# EAGLE design GPS_radiologger_v19_LoRa_only (EAGLE 9.6.2)
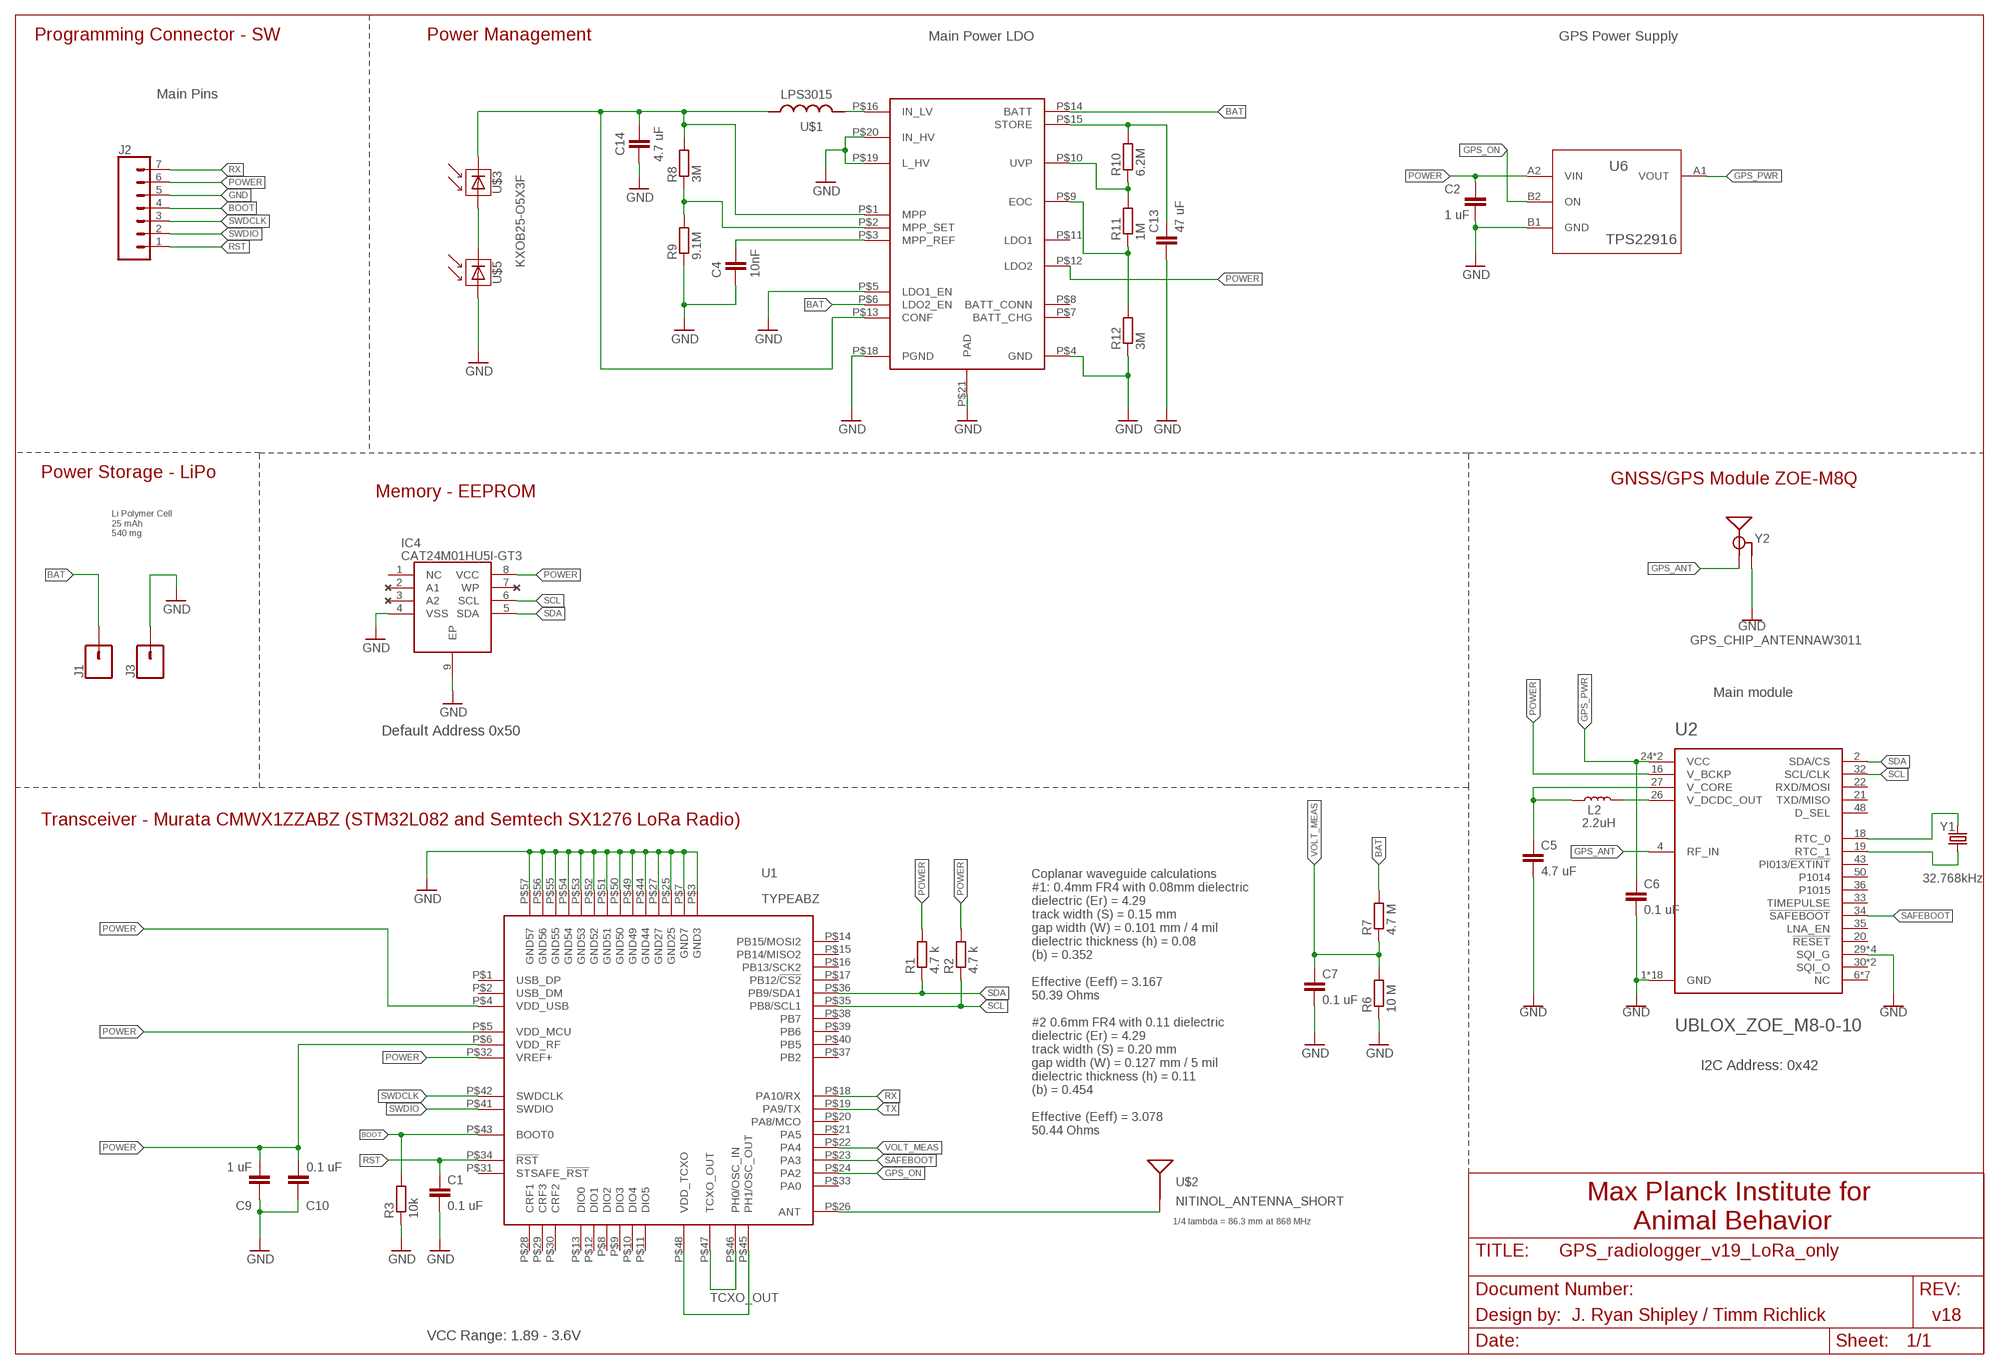
[diagram p0: schematic, sheet 1]

## Parts
C1  0.1 uF  C-EUC0201  [C0201]
C2  1 uF  C-EUC0201  [C0201]
C4  10nF  C-EUC0201  [C0201]
C5  4.7 uF  C-EUC0201  [C0201]
C6  0.1 uF  C-EUC0201  [C0201]
C7  0.1 uF  C-EUC0201  [C0201]
C9  1 uF  C-EUC0201  [C0201]
C10  0.1 uF  C-EUC0201  [C0201]
C13  47 uF  C-EUC0805K  [C0805K]
C14  4.7 uF  C-EUC0201  [C0201]
IC4  CAT24M01HU5I-GT3  [SON50P300X200X55-9N]
J1  CONN_01PTH_NO_SILK_YES_STOP  [1X01_NO_SILK]
J2  CONN_07NO_SILK  [1X07_NO_SILK]
J3  CONN_01PTH_NO_SILK_YES_STOP  [1X01_NO_SILK]
L2  2.2uH  2.2μH_SHIELDED_INDUCTOR  [0806]
R1  4.7 k  R-EU_R0201  [R0201]
R2  4.7 k  R-EU_R0201  [R0201]
R3  10k  R-EU_R0201  [R0201]
R6  10 M  R-EU_R0201  [R0201]
R7  4.7 M  R-EU_R0201  [R0201]
R8  3M  R-EU_R0201  [R0201]
R9  9.1M  R-EU_R0201  [R0201]
R10  6.2M  R-EU_R0201  [R0201]
R11  1M  R-EU_R0201  [R0201]
R12  3M  R-EU_R0201  [R0201]
U1  TYPEABZ  [TYPEABZ]
U2  UBLOX_ZOE_M8-0-10  [UBLOX_ZOE_M8-0-10]
U4  SPV1050  [SPV1050]
U6  TPS22916  [TPS22916]
U$1  LPS3015  [LPS_3015]
U$2  NITINOL_ANTENNA_SHORT  [ICARUS_NITINOL_ANTENNA_SHORT]
U$3  KXOB25-O5X3F  [KXOB25-05X3F]
U$5  KXOB25-O5X3F  [KXOB25-05X3F]
Y1  32.768kHz  CRYSTAL-32.768KHZSMD-3.2X1.5  [CRYSTAL-SMD-3.2X1.5MM]
Y2  GPS_CHIP_ANTENNAW3011  [W3011]

## Nets
BAT [battery]: J1.1 R7.2 U4.P$6(LDO2_EN) U4.P$14(BATT)
BOOT: J2.4 R3.2 U1.P$43(BOOT0)
GND: C1.2 C2.2 C4.2 C5.2 C6.2 C7.2 C9.1 C10.1 C13.2 C14.2 IC4.4(VSS) IC4.9(EP) J2.5 J3.1 R3.1 R6.1 R9.1 R12.1 U1.P$3(GND3) U1.P$7(GND7) U1.P$25(GND25) U1.P$27(GND27) U1.P$44(GND44) U1.P$49(GND49) U1.P$50(GND50) U1.P$51(GND51) U1.P$52(GND52) U1.P$53(GND53) U1.P$54(GND54) U1.P$55(GND55) U1.P$56(GND56) U1.P$57(GND57) U2.1(GND) U2.3(GND) U2.5(GND) U2.7(GND) U2.8(GND) U2.9(GND) U2.10(GND) U2.11(GND) U2.12(GND) U2.17(GND) U2.23(GND) U2.29(SQI_G) U2.31(SQI_G) U2.37(GND) U2.38(GND) U2.39(GND) U2.40(GND) U2.41(GND) U2.44(GND) U2.46(SQI_G) U2.47(SQI_G) U2.49(GND) U4.P$4(GND) U4.P$5(LDO1_EN) U4.P$18(PGND) U4.P$19(L_HV) U4.P$20(IN_HV) U4.P$21(PAD) U6.B1(GND) U$5.P$2(MINUS) Y2.2(GND) Y2.3(GND)
GPS_ANT: U2.4(RF_IN) Y2.1(SIGNAL)
GPS_ON: U1.P$24(PA2) U6.B2(ON)
GPS_PWR: C6.1 U2.24(VCC) U2.25(VCC) U6.A1(VOUT)
N$1: U1.P$45(PH1/OSC_OUT) U1.P$48(VDD_TCXO)
N$2: U$3.P$2(MINUS) U$5.P$1(PLUS)
N$3: L2.2 U2.26(V_DCDC_OUT)
N$4: U4.P$16(IN_LV) U$1.P$2
N$5: C5.1 L2.1 U2.27(V_CORE)
N$6: R8.1 R9.2 U4.P$2(MPP_SET)
N$7 [battery]: C14.1 R8.2 U4.P$1(MPP) U4.P$13(CONF) U$1.P$1 U$3.P$1(PLUS)
N$8: R10.1 R11.2 U4.P$10(UVP)
N$9: R11.1 R12.2 U4.P$9(EOC)
N$11 [antenna]: U1.P$26(ANT) U$2.1(SIGNAL) U$2.2(SIGNAL) U$2.3(SIGNAL)
N$12: C13.1 R10.2 U4.P$15(STORE)
N$13: C4.1 U4.P$3(MPP_REF)
N$14: U2.18(RTC_0) Y1.P$2
N$15: U2.19(RTC_1) Y1.P$1
POWER [power]: C2.1 C9.2 C10.2 IC4.8(VCC) J2.6 R1.2 R2.2 U1.P$4(VDD_USB) U1.P$5(VDD_MCU) U1.P$6(VDD_RF) U1.P$32(VREF+) U2.16(V_BCKP) U4.P$12(LDO2) U6.A2(VIN)
RST: C1.1 J2.1 U1.P$34(!RST)
RX: J2.7 U1.P$18(PA10/RX)
SAFEBOOT: U1.P$23(PA3) U2.34(!SAFEBOOT)
SCL: IC4.6(SCL) R2.1 U1.P$35(PB8/SCL1) U2.32(SCL/CLK)
SDA: IC4.5(SDA) R1.1 U1.P$36(PB9/SDA1) U2.2(SDA/CS)
SWDCLK: J2.3 U1.P$42(SWDCLK)
SWDIO: J2.2 U1.P$41(SWDIO)
TCXO_OUT: U1.P$46(PH0/OSC_IN) U1.P$47(TCXO_OUT)
TX: U1.P$19(PA9/TX)
VOLT_MEAS: C7.1 R6.2 R7.1 U1.P$22(PA4)
Unconnected: IC4.1(NC) IC4.2(A1) IC4.3(A2) IC4.7(WP) U1.P$1(USB_DP) U1.P$2(USB_DM) U1.P$8(DIO2) U1.P$9(DIO3) U1.P$10(DIO4) U1.P$11(DIO5) U1.P$12(DIO1) U1.P$13(DIO0) U1.P$14(PB15/MOSI2) U1.P$15(PB14/MISO2) U1.P$16(PB13/SCK2) U1.P$17(PB12/!CS2) U1.P$20(PA8/MCO) U1.P$21(PA5) U1.P$28(CRF1) U1.P$29(CRF3) U1.P$30(CRF2) U1.P$31(STSAFE_!RST) U1.P$33(PA0) U1.P$37(PB2) U1.P$38(PB7) U1.P$39(PB6) U1.P$40(PB5) U2.6(NC) U2.13(NC) U2.14(NC) U2.15(NC) U2.20(!RESET) U2.21(TXD/MISO) U2.22(RXD/MOSI) U2.28(NC) U2.30(SQI_O) U2.33(TIMEPULSE) U2.35(LNA_EN) U2.36(P1015) U2.42(NC) U2.43(PI013/!EXTINT) U2.45(SQI_O) U2.48(D_SEL) U2.50(P1014) U2.51(NC) U4.P$7(BATT_CHG) U4.P$8(BATT_CONN) U4.P$11(LDO1)

## Notes on the sheet
- Programming Connector - SW | Power Management | Main Power LDO | GPS Power Supply
- Main Pins
- Power Storage - LiPo
- GNSS/GPS Module ZOE-M8Q
- Memory - EEPROM
- Li Polymer Cell
  25 mAh
  540 mg
- Main module
- Default Address 0x50
- Transceiver - Murata CMWX1ZZABZ (STM32L082 and Semtech SX1276 LoRa Radio)
- I2C Address: 0x42
- Coplanar waveguide calculations
  #1: 0.4mm FR4 with 0.08mm dielectric 
  dielectric (Er) = 4.29
  track width (S) = 0.15 mm
  gap width (W) = 0.101 mm / 4 mil
  dielectric thickness (h) = 0.08
  (b) = 0.352
  
  Effective (Eeff) = 3.167
  50.39 Ohms
  
  #2 0.6mm FR4 with 0.11 dielectric
  dielectric (Er) = 4.29
  track width (S) = 0.20 mm
  gap width (W) = 0.127 mm / 5 mil
  dielectric thickness (h) = 0.11
  (b) = 0.454
  
  Effective (Eeff) = 3.078
  50.44 Ohms
- Max Planck Institute for 
  Animal Behavior
- 1/4 lambda = 86.3 mm at 868 MHz
- Design by: | J. Ryan Shipley / Timm Richlick | v18
- VCC Range: 1.89 - 3.6V

## Library data of the parts
C1 C2 C4-C7 C9 C10 C13 C14 = rcl:C-EU: CAPACITOR, European symbol; SPICEPREFIX: C
IC4 = CAT24M01HU5I-GT3-CorrectedV2:CAT24M01HU5I-GT3: EEPROM 1MB I2C SERIAL EEPROM Source: Datasheet <http://www.onsemi.com/pub/Collateral/CAT24M01-D.PDF>; ALLIED_NUMBER: 70300250; ALLIED_PRICE-STOCK: http://www.alliedelec.com/on-semiconductor-cat24m01hu5i-gt3/70300250/; DESCRIPTION: EEPROM 1MB I2C SERIAL EEPROM; HEIGHT: 0.55mm; MANUFACTURER_NAME: ON Semiconductor; MANUFACTURER_PART_NUMBER: CAT24M01HU5I-GT3; MOUSER_PART_NUMBER: 863-CAT24M01HU5I-GT3; MOUSER_PRICE-STOCK: https://www.mouser.com/Search/Refine.aspx?Keyword=863-CAT24M01HU5I-GT3; RS_PART_NUMBER: 7814831P; RS_PRICE-STOCK: http://uk.rs-online.com/web/p/products/7814831P
J1 J3 = SparkFun-Connectors:CONN_01: Single connection point. Often used as Generic Header-pin footprint for 0.1 inch spaced/style header connections On any of the 0.1 inch spaced packages, you can populate with these: Break Away Headers - Straight <https://www.sparkfun.com/products/116> (PRT-00116) Break Away Male Headers - Right Angle <https://www.sparkfun.com/products/553> (PRT-00553) Female Headers <https://www.sparkfun.com/products/115> (PRT-00115) Break Away Headers - Machine Pin <https://www.sparkfun.com/products/117> (PRT-00117) Break Away Female Headers - Swiss Machine Pin <https://www.sparkfun.com/products/743> (PRT-00743) This device is also useful as a general connection point to wire up your design to another part of your project. Our various solder wires solder well into these plated through hole pads. Hook-Up Wire - Assortment (Stranded, 22 AWG) <https://www.sparkfun.com/products/11375> (PRT-11375) Hook-Up Wire - Assortment (Solid Core, 22 AWG) <https://www.sparkfun.com/products/11367> (PRT-11367) View the entire wire category on our website here <https://www.sparkfun.com/categories/141> Special notes: SMTSO-256-ET is a "flush mount" nut for a 4-40 screw. We mostly use this on specialty testbeds; it is a nice way to connect hardware to your PCB at an adjustable hieght. Also note, the SNAP packages are for using a snappable style connector. We sell a baggie of snaps and they are also used on two LilyPad designs: Snap Assortment - 30 pack (male and female) <https://www.sparkfun.com/products/11347> (DEV-11347) LilyPad Arduino SimpleSnap <https://www.sparkfun.com/products/10941> (DEV-10941) LilyPad SimpleSnap Protoboard <https://www.sparkfun.com/products/10940> (DEV-10940)
J2 = SparkFun-Connectors:CONN_07: Multi connection point. Often used as Generic Header-pin footprint for 0.1 inch spaced/style header connections On any of the 0.1 inch spaced packages, you can populate with these: Break Away Headers - Straight <https://www.sparkfun.com/products/116> (PRT-00116) Break Away Male Headers - Right Angle <https://www.sparkfun.com/products/553> (PRT-00553) Female Headers <https://www.sparkfun.com/products/115> (PRT-00115) Break Away Headers - Machine Pin <https://www.sparkfun.com/products/117> (PRT-00117) Break Away Female Headers - Swiss Machine Pin <https://www.sparkfun.com/products/743> (PRT-00743) For SCREWTERMINALS and SPRING TERMINALS visit here: Screw Terimnals on SparkFun.com <https://www.sparkfun.com/search/results?term=Screw+Terminals> (5mm/3.5mm/2.54mm spacing) This device is also useful as a general connection point to wire up your design to another part of your project. Our various solder wires solder well into these plated through hole pads. Hook-Up Wire - Assortment (Stranded, 22 AWG) <https://www.sparkfun.com/products/11375> (PRT-11375) Hook-Up Wire - Assortment (Solid Core, 22 AWG) <https://www.sparkfun.com/products/11367> (PRT-11367) View the entire wire category on our website here <https://www.sparkfun.com/categories/141> Special notes: Molex polarized connector foot print use with SKU : PRT-08231 with associated crimp pins and housings. 1MM SMD Version SKU: PRT-10208 NOTES ON THE VARIANTS LOCK and LOCK_LONGPADS... This footprint was designed to help hold the alignment of a through-hole component (i.e. 6-pin header) while soldering it into place. You may notice that each hole has been shifted either up or down by 0.005 of an inch from it's more standard position (which is a perfectly straight line). This slight alteration caused the pins (the squares in the middle) to touch the edges of the holes. Because they are alternating, it causes a "brace" to hold the component in place. 0.005 has proven to be the perfect amount of "off-center" position when using our standard breakaway headers. Although looks a little odd when you look at the bare footprint, once you have a header in there, the alteration is very hard to notice. Also,if you push a header all the way into place, it is covered up entirely on the bottom side.
L2 = SparkFun-Coils:2.2μH_SHIELDED_INDUCTOR: Murata 2.2uH Inductor 2.2uH 1.2A 110mOhm 0806 Package Shielded; PROD_ID: NDUC-14257
R1-R3 R6-R12 = rcl:R-EU_: RESISTOR, European symbol; SPICEPREFIX: R
U1 = Kris:TYPEABZ: CMWX1ZZABZ-078
U2 = SparkFun-GPS:UBLOX_ZOE_M8-0-10: UBLOX ZOE-M8Q-0-10 u-blox ZOE-M8 standard precision GNSS SiP (System in Package) modules feature the high performance u-blox M8 GNSS engine. ZOE-M8’s ultra-miniature form factor integrates a complete GNSS receiver including SAW filter, LNA and TCXO. Handles all GNSS systems and can simulatenously use up to three of them, with accuracy ranging from 2.5m to 4m. GPS GLONASS BeiDou Galileo This can be corrected with the SBAS or QZSS augmentation systems.; PROD_ID: IC-14251
U4 = STM-SPV1050_V2:SPV1050
U6 = TPS22916V2:TPS22916: Linear Regulator; AVAILABILITY: Unavailable; DESCRIPTION: Linear Voltage Regulator IC 1 Output 150mA 4-DSBGA (1x1); MF: Texas Instruments; MP: LP5900TL-3.0; PACKAGE: WFBGA-4 Texas Instruments; PRICE: None
U$1 = coilcraft_custom:LPS3015
U$2 = Antenna_mounts:NITINOL_ANTENNA_SHORT
U$3 U$5 = AnySolar:KXOB25-O5X3F
Y1 = SparkFun-Clocks:CRYSTAL-32.768KHZ: 32.768kHz Crystal Frequency: 32.768kHz Frequency Stability: ±20ppm Load Capacitance: 12.5pF (PTH-2X6 & SMD-3.2X1.5), 6pF (SMD-2X6) SparkFun Products: SparkFun BigTime Watch Kit <https://www.sparkfun.com/products/11734> SparkFun nRF52832 Breakout <https://www.sparkfun.com/products/13990> SparkFun Real Time Clock Module <https://www.sparkfun.com/products/12708>; PROD_ID: XTAL-13062
Y2 = SparkFun-GPS:GPS_CHIP_ANTENNA; PROD_ID: ANT-14304

## Net classes
1 power: width 0.305 mm
2 antenna: width 0.203 mm, clearance 0.127 mm
3 battery: width 0.254 mm

## Board
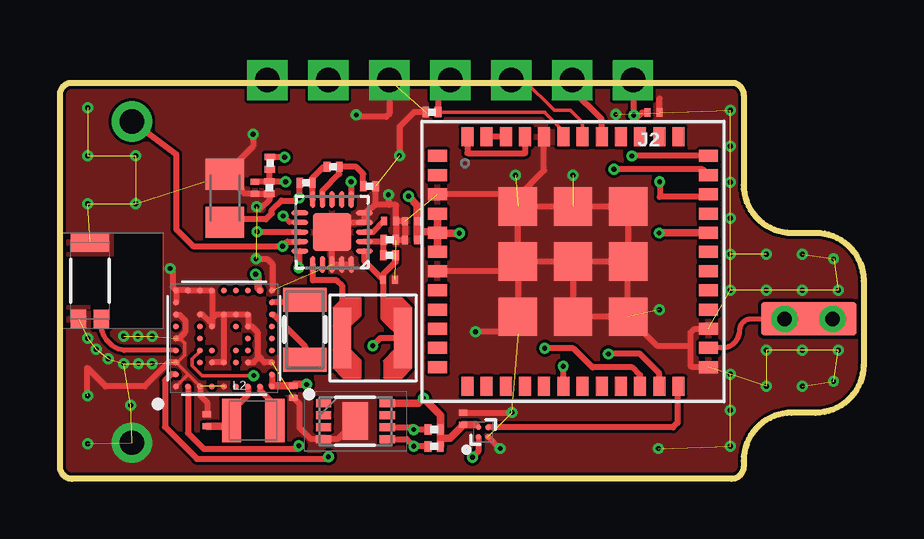
[diagram p1: board, top side]
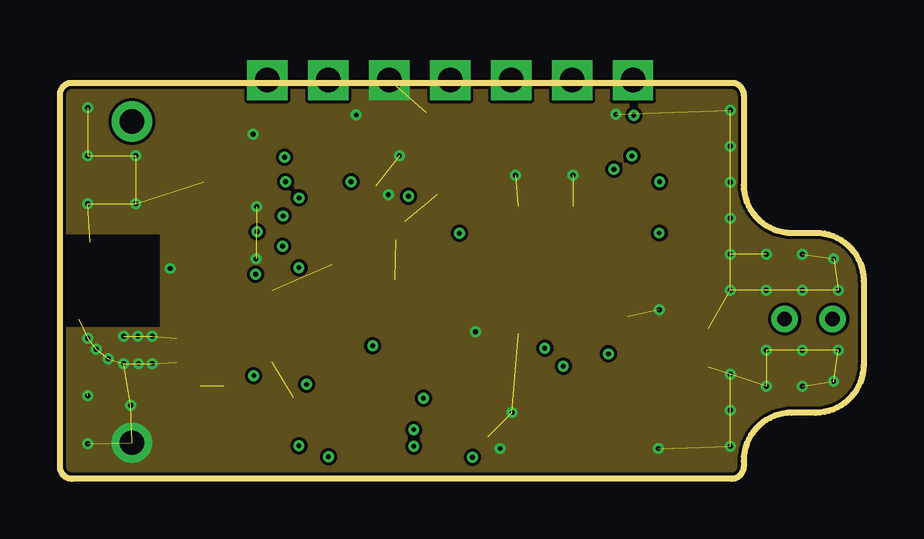
[diagram p2: board, inner layer Route2]
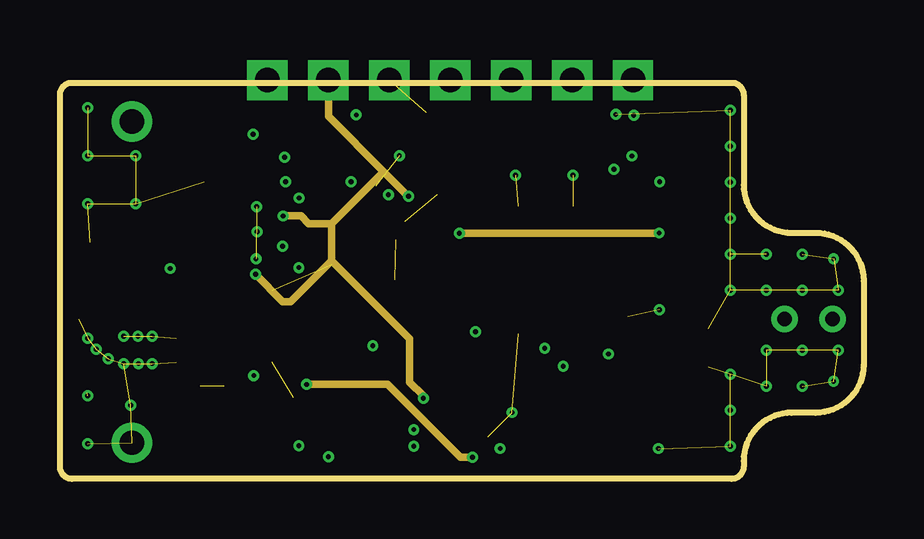
[diagram p3: board, inner layer Route15]
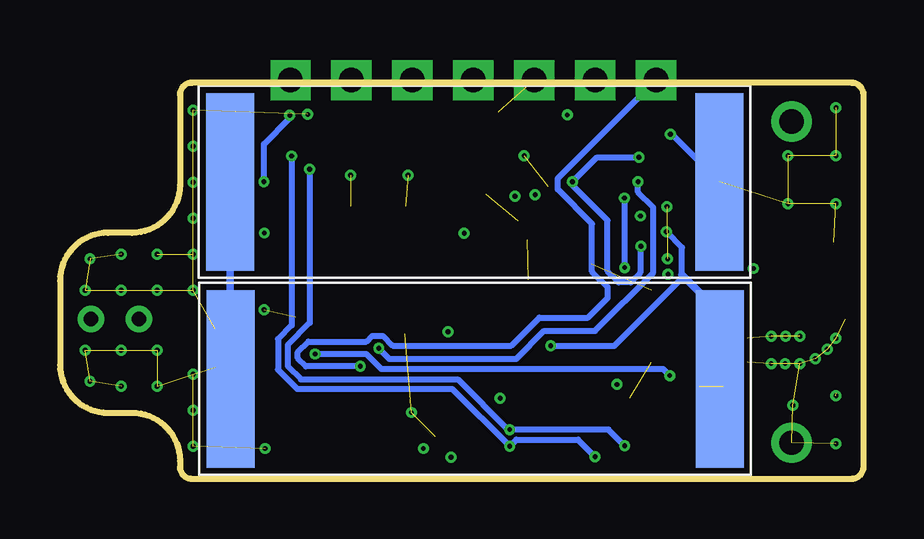
[diagram p4: board, bottom side, seen from below]

Size 33.5 x 16.5 mm. Coordinates in mm from the lower left corner, seen from the top.
Outline: 0.5,16.5 28,16.5 arc-90 28.5,16 28.5,12.25 arc90 30.5,10.25 31.5,10.25 arc-90 33.5,8.25 33.5,4.75 arc-90 31.5,2.75 30.5,2.75 arc90 28.5,0.75 28.5,0.5 arc-90 28,0 0.5,0 arc-90 0,0.5 0,16 arc-90 0.5,16.5
Copper layers (1*2+15*16): Top 0.035mm / dielectric 0.11mm / Route2 0.035mm / dielectric 0.2mm / Route15 0.035mm / dielectric 0.11mm / Bottom 0.035mm
Design rules "default *": minimum track width 5mil, minimum drill 0.2mm, track to track 5mil, track to pad 5mil, pad to pad 5mil, via to via 5mil, smd to smd 5mil, copper to edge 5mil, drill to drill 5mil, minimum pad ring 10mil, minimum via ring 5mil, stop-mask expansion 0mil, vias tented up to drill 12mil, thermal gap 0mil

### Footprints (pad centres in the part's own frame; a part is rotated, then mirrored left to right if it is on the bottom)
C0201 = smd 0.25 x 0.35: 1 -0.25,0; 2 0.25,0
C0805K = smd 1.3 x 1.6: 1 -1,0; 2 1,0
SON50P300X200X55-9N = smd 0.63 x 0.32: 1 -1.33,0.75; 2 -1.33,0.25; 3 -1.33,-0.25; 4 -1.33,-0.75; 5 1.33,-0.75; 6 1.33,-0.25; 7 1.33,0.25; 8 1.33,0.75 | smd 1.06 x 1.56: 9 0,0
1X01_NO_SILK = drill 1.016 pad 1.676: 1 0,0
1X07_NO_SILK = drill 1.016 pad 1.676 square: 1 0,0; 2 2.54,0; 3 5.08,0; 4 7.62,0; 5 10.16,0; 6 12.7,0; 7 15.24,0
0806 = smd 0.8 x 1.8: 1 -0.9,0; 2 0.9,0
R0201 = smd 0.28 x 0.43: 1 -0.255,0; 2 0.255,0
TYPEABZ = smd 0.8 x 0.5: P$1 -5.65,4.4; P$2 -5.65,3.6; P$3 -5.65,2.8; P$4 -5.65,2; P$5 -5.65,1.2; P$6 -5.65,0.4; P$7 -5.65,-0.4; P$8 -5.65,-1.2; P$9 -5.65,-2; P$10 -5.65,-2.8; P$11 -5.65,-3.6; P$12 -5.65,-4.4; P$25 5.65,-4.4; P$26 5.65,-3.6; P$27 5.65,-2.8; P$28 5.65,-2; P$29 5.65,-1.2; P$30 5.65,-0.4; P$31 5.65,0.4; P$32 5.65,1.2; P$33 5.65,2; P$34 5.65,2.8; P$35 5.65,3.6; P$36 5.65,4.4 | smd 0.5 x 0.8: P$13 -4.4,-5.2; P$14 -3.6,-5.2; P$15 -2.8,-5.2; P$16 -2,-5.2; P$17 -1.2,-5.2; P$18 -0.4,-5.2; P$19 0.4,-5.2; P$20 1.2,-5.2; P$21 2,-5.2; P$22 2.8,-5.2; P$23 3.6,-5.2; P$24 4.4,-5.2; P$37 4.4,5.2; P$38 3.6,5.2; P$39 2.8,5.2; P$40 2,5.2; P$41 1.2,5.2; P$42 0.4,5.2; P$43 -0.4,5.2; P$44 -1.2,5.2; P$45 -2,5.2; P$46 -2.8,5.2; P$47 -3.6,5.2; P$48 -4.4,5.2 | smd 1.6 x 1.6: P$49 -2.3,2.3; P$50 0,2.3; P$51 2.3,2.3; P$52 -2.3,0; P$53 0,0; P$54 2.3,0; P$55 -2.3,-2.3; P$56 0,-2.3; P$57 2.3,-2.3
UBLOX_ZOE_M8-0-10 = smd 0.25 x 0.25: 1 -1.996,2.004; 2 -1.496,2.004; 3 -0.996,2.004; 4 -0.496,2.004; 5 0.004,2.004; 6 0.504,2.004; 7 1.004,2.004; 8 1.504,2.004; 9 2.004,2.004; 10 2.004,1.504; 11 2.004,1.004; 12 2.004,0.504; 13 2.004,0.004; 14 2.004,-0.496; 15 2.004,-0.996; 16 2.004,-1.496; 17 2.004,-1.996; 18 1.504,-1.996; 19 1.004,-1.996; 20 0.504,-1.996; 21 0.004,-1.996; 22 -0.496,-1.996; 23 -0.996,-1.996; 24 -1.496,-1.996; 25 -1.996,-1.996; 26 -1.996,-1.496; 27 -1.996,-0.996; 28 -1.996,-0.496; 29 -1.996,0.004; 30 -1.996,0.504; 31 -1.996,1.004; 32 -1.996,1.504; 33 -0.996,1.004; 34 -0.496,1.004; 35 0.004,1.004; 36 0.504,1.004; 37 1.004,1.004; 38 1.004,0.004; 39 1.004,-0.496; 40 1.004,-0.996; 41 0.504,-0.996; 42 0.004,-0.996; 43 -0.496,-0.996; 44 -0.996,-0.996; 45 -0.996,-0.496; 46 -0.996,0.004; 47 -0.996,0.504; 48 -0.496,0.504; 49 0.504,0.504; 50 0.504,-0.496; 51 -0.496,-0.496
SPV1050 = smd 0.7 x 0.2: P$1 -1.35,0.8; P$2 -1.35,0.4; P$3 -1.35,0; P$4 -1.35,-0.4; P$5 -1.35,-0.8; P$11 1.35,-0.8; P$12 1.35,-0.4; P$13 1.35,0; P$14 1.35,0.4; P$15 1.35,0.8 | smd 0.2 x 0.7: P$6 -0.8,-1.35; P$7 -0.4,-1.35; P$8 0,-1.35; P$9 0.4,-1.35; P$10 0.8,-1.35; P$16 0.8,1.35; P$17 0.4,1.35; P$18 0,1.35; P$19 -0.4,1.35; P$20 -0.8,1.35 | smd 1.6 x 1.6: P$21 0,0
TPS22916 = smd 0.23 x 0.23: A1 -0.254,0.254; A2 0.144,0.254; B1 -0.254,-0.144; B2 0.144,-0.144
LPS_3015 = smd 0.75 x 2.54: P$1 -1.3,0; P$2 1.25,0
ICARUS_NITINOL_ANTENNA_SHORT = smd 4 x 1.4: 1 0,0 | drill 0.6: 2 -1,0; 3 1,0
KXOB25-05X3F = smd 7.4 x 2: P$1 0,10.2; P$2 0,-10.2
CRYSTAL-SMD-3.2X1.5MM = smd 1 x 1.8: P$1 -1.25,0; P$2 1.25,0
W3011 = smd 0.8 x 0.65: 1 1.6,0.475; 2 1.6,-0.475 | smd 0.8 x 1.6: 3 -1.6,0

### Placement (x,y rotation side)
C1  24.74,15.26 0 top
C2  16.8,2.5 90 top
C4  13.77,10.74 0 top
C5  6.13,2.44 90 top
C6  9.73,3.62 270 top
C7  8.12,12.13 270 top
C9  14.64,9.95 0 top
C10  14.64,10.73 0 top
C13  6.88,11.69 90 top
C14  13.72,8.29 0 top
IC4  12.32,2.4 0 top
J1  3,14.89 0 top
J2  23.89,16.61 180 top
J3  3,1.5 0 top
L2  8.06,2.43 0 top
R1  15.6,1.35 0 top
R2  15.6,2.05 0 top
R3  15.51,15.28 0 top
R6  8.73,12.13 90 top
R7  8.76,13.15 90 top
R8  13.73,9.31 0 top
R9  13.75,9.96 180 top
R10  10.26,12.33 180 top
R11  11.39,13 180 top
R12  12.9,12.19 180 top
U1  21.39,9.05 0 top
U2  6.84,5.85 90 top
U4  11.34,10.28 180 top
U6  17.7,2 90 top
U$1  13,5.87 180 top
U$2  31.21,6.66 0 top
U$3  16.19,4.16 270 bottom
U$5  16.21,12.37 90 bottom
Y1  10.21,6.21 90 top
Y2  1.25,8.25 270 top

### Tracks (layer width: path | path; a pad name or v marks a point on that pad's centre or on a via)
BAT  (via drill 0.2)
  Top 0.254: v12.13,12.37 v12.14,12.36 U4.P$6 | J1.1 4.85,13.52 4.85,10.39 5.55,9.69 v9.28,9.69 9.47,9.88 U4.P$14 | v9.37,13.39 8.78,13.39 R7.2
  Bottom 0.254: v9.28,9.69 9.31,9.66 9.31,8.59 9.72,8.18 10.2,8.18 10.67,8.65 10.67,10.77 12.13,12.22 v12.13,12.37 11.11,13.39 v9.37,13.39
BOOT
  Top 0.152: 20.22,15.28 20.2,15.28 | 20.2,15.28 R3.2 | 20.2,15.28 20.99,14.49 U1.P$43
  Top 0.254: J2.4 15.76,16.1 R3.2
GND  (via drill 0.2)  (57 unrouted)
  Top 0.152: U2.31 5.36,4.33 | 5.36,4.33 4.88,4.81 4.88,4.85 | 4.99,5.87 5.21,5.65 5.21,5.14 4.92,4.85 U2.3 | U2.1 5.32,4.33 5.36,4.33
  Top 0.254: U4.P$20 U4.P$19 U4.P$18 U4.P$21 11.74,10.68 U4.P$4 U4.P$5 13.15,11.41 | U2.47 U2.46 U2.38 | U2.9 U2.8 | U2.9 U2.10 U2.11 U2.12 U2.49 6.34,6.65 | U2.37 5.94,6.85 6.24,6.55 6.34,6.65 | 6.34,6.65 6.54,6.85 U2.38 | 4.88,6.85 U2.7 4.86,6.83 4.99,6.83 5.21,6.61 5.21,6.1 4.99,5.87 | 4.88,4.85 U2.3 4.54,4.85 3.54,3.85 1.9,3.85 1.13,4.62 1.13,3.58 | U2.44 8.08,4.85 8.3,5.07 8.52,4.85 U2.23 | 8.25,5.12 8.25,6.08 7.98,6.35 U2.41 U2.40 U2.39 U2.38 | U1.P$49 U1.P$50 U1.P$51 U1.P$54 | U1.P$54 U1.P$53 | U1.P$53 U1.P$52 | U1.P$52 U1.P$49 | U1.P$52 U1.P$55 | U1.P$55 19.09,6.08 19.12,6.05 | U1.P$53 U1.P$56 U1.P$57 | U1.P$57 U1.P$54 | U1.P$52 18.69,8.65 U1.P$7 | U1.P$3 18.59,11.85 U1.P$49 | U1.P$57 24.89,5.55 26.25,5.55 26.3,5.5 | C9.1 C10.1 C4.2 | C9.1 14.38,9.94 | C4.2 14.02,10.06 | 14.02,10.06 R9.1 | 13.15,11.41 R12.1 | C4.2 14.02,11.39 13.99,11.41 13.7,11.41 | 13.7,11.41 13.15,11.41 | C9.1 14.13,9.95 14.02,10.06 | IC4.9 11.57,1.65 IC4.4 10.46,1.65 9.98,2.13 9.98,3.12 C6.2 | 20.15,14.29 U1.P$44 20.19,12.85 19.09,11.75 U1.P$49 | J2.5 13.73,15.21 13.6,15.07 12.44,15.07 v12.35,15.16 | v13.69,11.83 13.69,11.43 13.7,11.41 | U1.P$55 18.46,6.12 v17.32,6.12 | U2.17 8.87,7.89 8.87,8.93 8.64,9.16 v8.17,9.16 | v8.2,11.34 8.32,11.22 8.73,11.63 R6.1 C7.2 7.69,11.88 C13.2 8.05,13.86 v8.05,14.36 | R3.1 14.77,15.28 14.15,14.66 v14.15,13.46 | C1.2 24.99,15.85 | U1.P$25 26.35,4.65 26.3,4.7 26.3,5.5 | 26.3,5.5 26.3,6.1 26.45,6.25 U1.P$27 | U6.B1 17.86,1.75 v18.35,1.26 | C2.2 v18.85,2.76 | C5.2 6.13,3.19 5.84,3.48 U2.31 | U2.9 4.69,8 4.69,8.66 v4.59,8.76 | 4.97,5.85 U2.5
  Bottom 0.254: U$5.P$2 8,14.36 v8.05,14.36
  other vias: 1.15,11.46 1.15,15.46 1.15,13.46 3.15,13.46 3.15,11.46 3.25,5.94 2.95,3.06 1.15,3.46 1.15,1.46 24.95,1.26 1.51,5.4 3.85,5.94 3.27,4.8 2.65,4.8 2.01,5 2.65,5.94 18.99,12.64 21.39,12.64 24.99,7.04 3.85,4.8 1.15,5.86 23.17,15.18 27.95,7.86 29.45,7.86 30.95,7.86 32.45,7.86 32.45,5.36 30.95,5.36 29.45,5.36 27.95,4.36 29.45,9.36 30.95,9.36 32.25,9.16 32.25,4.06 30.95,3.86 29.45,3.86 27.95,9.36 27.95,10.86 27.95,2.86 27.95,12.36 27.95,13.86 27.95,15.36 27.95,1.36
  pour Top: -0.41,16.73 34.26,16.73 34.26,-0.95 -0.41,-0.95
  pour Route2: -0.29,-0.61 -0.3,6.1 -0.3,6.2 4.3,6.2 4.3,10.3 -0.2,10.3 -0.2,16.9 7.4,16.9 7.4,16.5 25.1,16.5 25.1,16.9 25.8,16.9 33.85,16.83 33.85,-0.61
GPS_ANT
  Top 0.203: U2.4 2.66,5.35 arc-90 Y2.1
GPS_ON
  Top 0.254: U1.P$24 25.74,3.8 25.74,2.33 25.62,2.21 25.55,2.14 U6.B2
GPS_PWR  (via drill 0.2)
  Top 0.254: U2.24 8.84,3.9 U2.25 | U6.A1 17.45,1.15 v17.2,0.9
  Top 0.305: v10.28,3.93 9.79,3.93 C6.1 8.87,3.87 8.84,3.9
  Route15 0.305: v10.28,3.93 13.66,3.93 16.69,0.9 v17.2,0.9
N$1
  Top 0.254: U1.P$45 19.39,13.57 16.99,13.57 U1.P$48
N$2
  Bottom 0.305: U$5.P$1 26.41,4.18 U$3.P$2
N$3
  Top 0.254: L2.2 8.96,3.06 8.34,3.68 U2.26
N$4
  Top 0.254: U$1.P$2 11.75,8.06 11.54,8.27 10.54,8.27 U4.P$16
N$5
  Top 0.254: L2.1 7.16,1.87 6.96,2.07 6.96,2.63 7.84,3.5 U2.27
  Top 0.305: C5.1 6.92,2.19 L2.1
N$6
  Top 0.254: R8.1 13.48,9.94 R9.2 13.42,9.88 U4.P$2
N$7  (via drill 0.2)
  Top 0.254: R8.2 13.99,9.04 13.47,8.52 C14.1 | U4.P$13 v8.23,10.28 v8.22,10.29 | v13.04,5.54 13.37,5.87 U$1.P$1 13.47,6.7 C14.1 | C14.1 12.69,9.07 U4.P$1
  Bottom 0.254: v8.22,10.29 7.56,9.63 7.56,8.5 7.56,8.37 10.39,5.54 v13.04,5.54
  Bottom 0.305: 7.56,8.5 5.99,6.93 U$3.P$1
N$8
  Top 0.254: R11.2 10.98,13 10.52,12.53 R10.1 10.52,11.65 U4.P$10
N$9
  Top 0.254: U4.P$9 10.94,11.99 11.64,12.7 R11.1 12.35,13 12.64,12.7 R12.2
N$11
  Top 0.203: U1.P$26 27.59,5.45 arc90 28.34,6.2 arc-90 28.8,6.66 U$2.2
  Top 0.305: U$2.2 U$2.1 U$2.3
N$12  (via drill 0.2)
  Top 0.254: R10.2 9.97,12.29 v9.97,11.7 9.86,11.59 9.23,11.59 8.83,11.19 8.83,11.06 8.58,10.81 7,10.81 C13.1 | U4.P$15 9.96,9.45 v9.96,8.8
  Bottom 0.254: v9.97,11.7 v9.96,11.69 v9.96,8.8
N$13
  Top 0.254: C4.1 13.05,10.28 U4.P$3
N$14
  Top 0.254: Y1.P$2 10.1,7.35 U2.18
N$15
  Top 0.254: U2.19 8.89,6.85 10.21,5.53 Y1.P$1
POWER  (via drill 0.2)
  Top 0.2: U6.A2 17.35,2.24 | U4.P$12 9.57,10.68 v9.3,10.95
  Top 0.305: v14.53,11.77 14.89,11.4 C10.2 14.89,10.3 | C9.2 14.89,10.3 | U1.P$5 15.69,10.3 14.89,10.3 | U1.P$4 U1.P$5 | U1.P$5 U1.P$6 | U1.P$5 15.76,10.23 v16.65,10.23 | U1.P$32 27.03,10.24 v24.98,10.24 | U2.16 8.25,7.94 8.25,8.42 v8.15,8.52 | 15.86,1.7 R2.2 15.86,2.65 v15.15,3.35 14.95,3.15 IC4.8 | 15.86,1.7 R1.2 | 15.86,1.7 15.87,1.69 16.25,1.69 16.8,2.24 C2.1 17.35,2.24
  Route15 0.254: v24.98,10.24 v24.97,10.23
  Route15 0.305: v8.15,8.52 9.29,7.38 9.62,7.38 11.33,9.09 | v15.15,3.35 15.15,3.45 14.57,4.03 14.57,5.84 11.33,9.09 | v9.3,10.95 10.05,10.95 10.37,10.63 11.33,10.63 | J2.6 11.19,15.1 13.49,12.79 | v24.97,10.23 v16.65,10.23 | v14.53,11.77 v14.52,11.77 13.49,12.79 | 13.49,12.79 11.33,10.63 | 11.33,10.63 11.33,9.09
RST  (via drill 0.2)
  Top 0.254: U1.P$34 26.93,11.74 25,11.74 v25,12.37 | J2.1 23.92,16.58 v23.92,15.14 24.04,15.02 24.27,15.26 C1.1
  Bottom 0.254: v25,12.37 25,13.94 23.92,15.02 v23.92,15.14
RX  (via drill 0.2)
  Top 0.254: U1.P$18 v20.98,4.68
  Bottom 0.254: v20.98,4.68 23.24,4.68 23.59,5.03 23.59,5.27 23.14,5.72 20.72,5.72 20.48,5.96 20.04,5.96 19.63,5.55 14.68,5.55 13.52,6.71 11.49,6.71 10.66,7.54 10.66,7.98 11.31,8.63 11.31,10.62 12.75,12.06 12.75,12.51 J2.7
SAFEBOOT  (via drill 0.2)
  Top 0.152: v8.08,4.3 5.93,4.3 5.51,4.72 5.51,4.99 5.84,5.32 U2.34
  Top 0.254: U1.P$23 24.99,4.39 24.18,5.2 v22.87,5.2
  Bottom 0.254: v22.87,5.2 20.73,5.2 20.11,4.58 8.36,4.58 v8.08,4.3
SCL  (via drill 0.2)
  Top 0.254: U1.P$35 26.8,12.89 v23.09,12.89 | IC4.6 14.65,2.15 v14.75,2.05 R2.1 | U2.32 5.34,1.91 5.99,1.25 9.96,1.25 v9.96,1.38
  Bottom 0.254: v14.75,2.05 14.74,1.97 14.82,2.05 | v23.09,12.89 23.09,6.49 24.01,5.57 24.01,4.7 23.45,4.14 16.91,4.14 14.82,2.05 | v9.96,1.38 10.63,2.05 14.82,2.05
SDA  (via drill 0.2)
  Top 0.254: U1.P$36 v23.84,13.45 | IC4.5 14.45,1.65 v14.75,1.35 R1.1 | U2.2 4.64,4.35 4.38,4.1 4.38,2.16 5.71,0.83 11.1,0.83 v11.19,0.92
  Bottom 0.254: v23.84,13.45 23.84,6.39 24.41,5.82 24.41,4.55 23.61,3.75 17.15,3.75 v14.75,1.35 14.47,1.63 11.9,1.63 v11.19,0.92
SWDCLK
  Top 0.152: U1.P$42 21.79,14.85 21.29,15.35 20.61,15.35 19.35,16.61
  Top 0.254: 19.35,16.61 J2.3
SWDIO
  Top 0.254: U1.P$41 22.59,14.97 21.35,16.21 J2.2
TCXO_OUT
  Top 0.254: U1.P$46 U1.P$47
VOLT_MEAS  (via drill 0.2)
  Top 0.254: v20.21,5.44 21.4,5.44 22.2,4.64 23.86,4.64 24.19,4.31 U1.P$22 | R6.2 C7.1 | R6.2 8.73,12.88 R7.1 | v9.4,12.38 R6.2
  Bottom 0.254: v20.21,5.44 19.77,5 14.47,5 13.31,6.16 11.19,6.16 8.76,8.59 8.76,11.3 9.4,11.94 v9.4,12.38

### Text on the board
tValues: + | -